# Altium schematic sheet VME_buffers.SchDoc: VME buffers
size 420 x 297 mm; CheckedBy: T.Janicki; CompanyName: Creotech Instruments SA; DrawnBy: G.Kasprowicz; Organization: CERN; Address1: European Organization for Nuclear Research; Address2: CH-1211 Geneve 23 - Switzerland; Revision: -; SheetNumber: 19; SheetTotal: 21; EDA_Number: EDA-xxxx; Projet: Simple VME FMC Carrier; ModifiedBy: -; CreateDate: 26/04/2012; CheckedDate: 30/04/2012; DivGrp: BE-CO; Designer: G.Kasprowicz; PageSetup: Record=PageOptions|CenterHorizontal=True|CenterVertical=True|PrintScale=0.95|XCorrection=1.00|YCorrection=1.00|PrintKind=1|BorderSize=5000000|LeftOffset=0|BottomOffset=0|Orientation=2|PaperLength=1000|PaperWidth=1000|Scale=100|PaperSource=15|PrintQuality=600|MediaType=1|DitherType=10|PaperKind=A3|PrintScaleMode=1; ModifiedDate: -
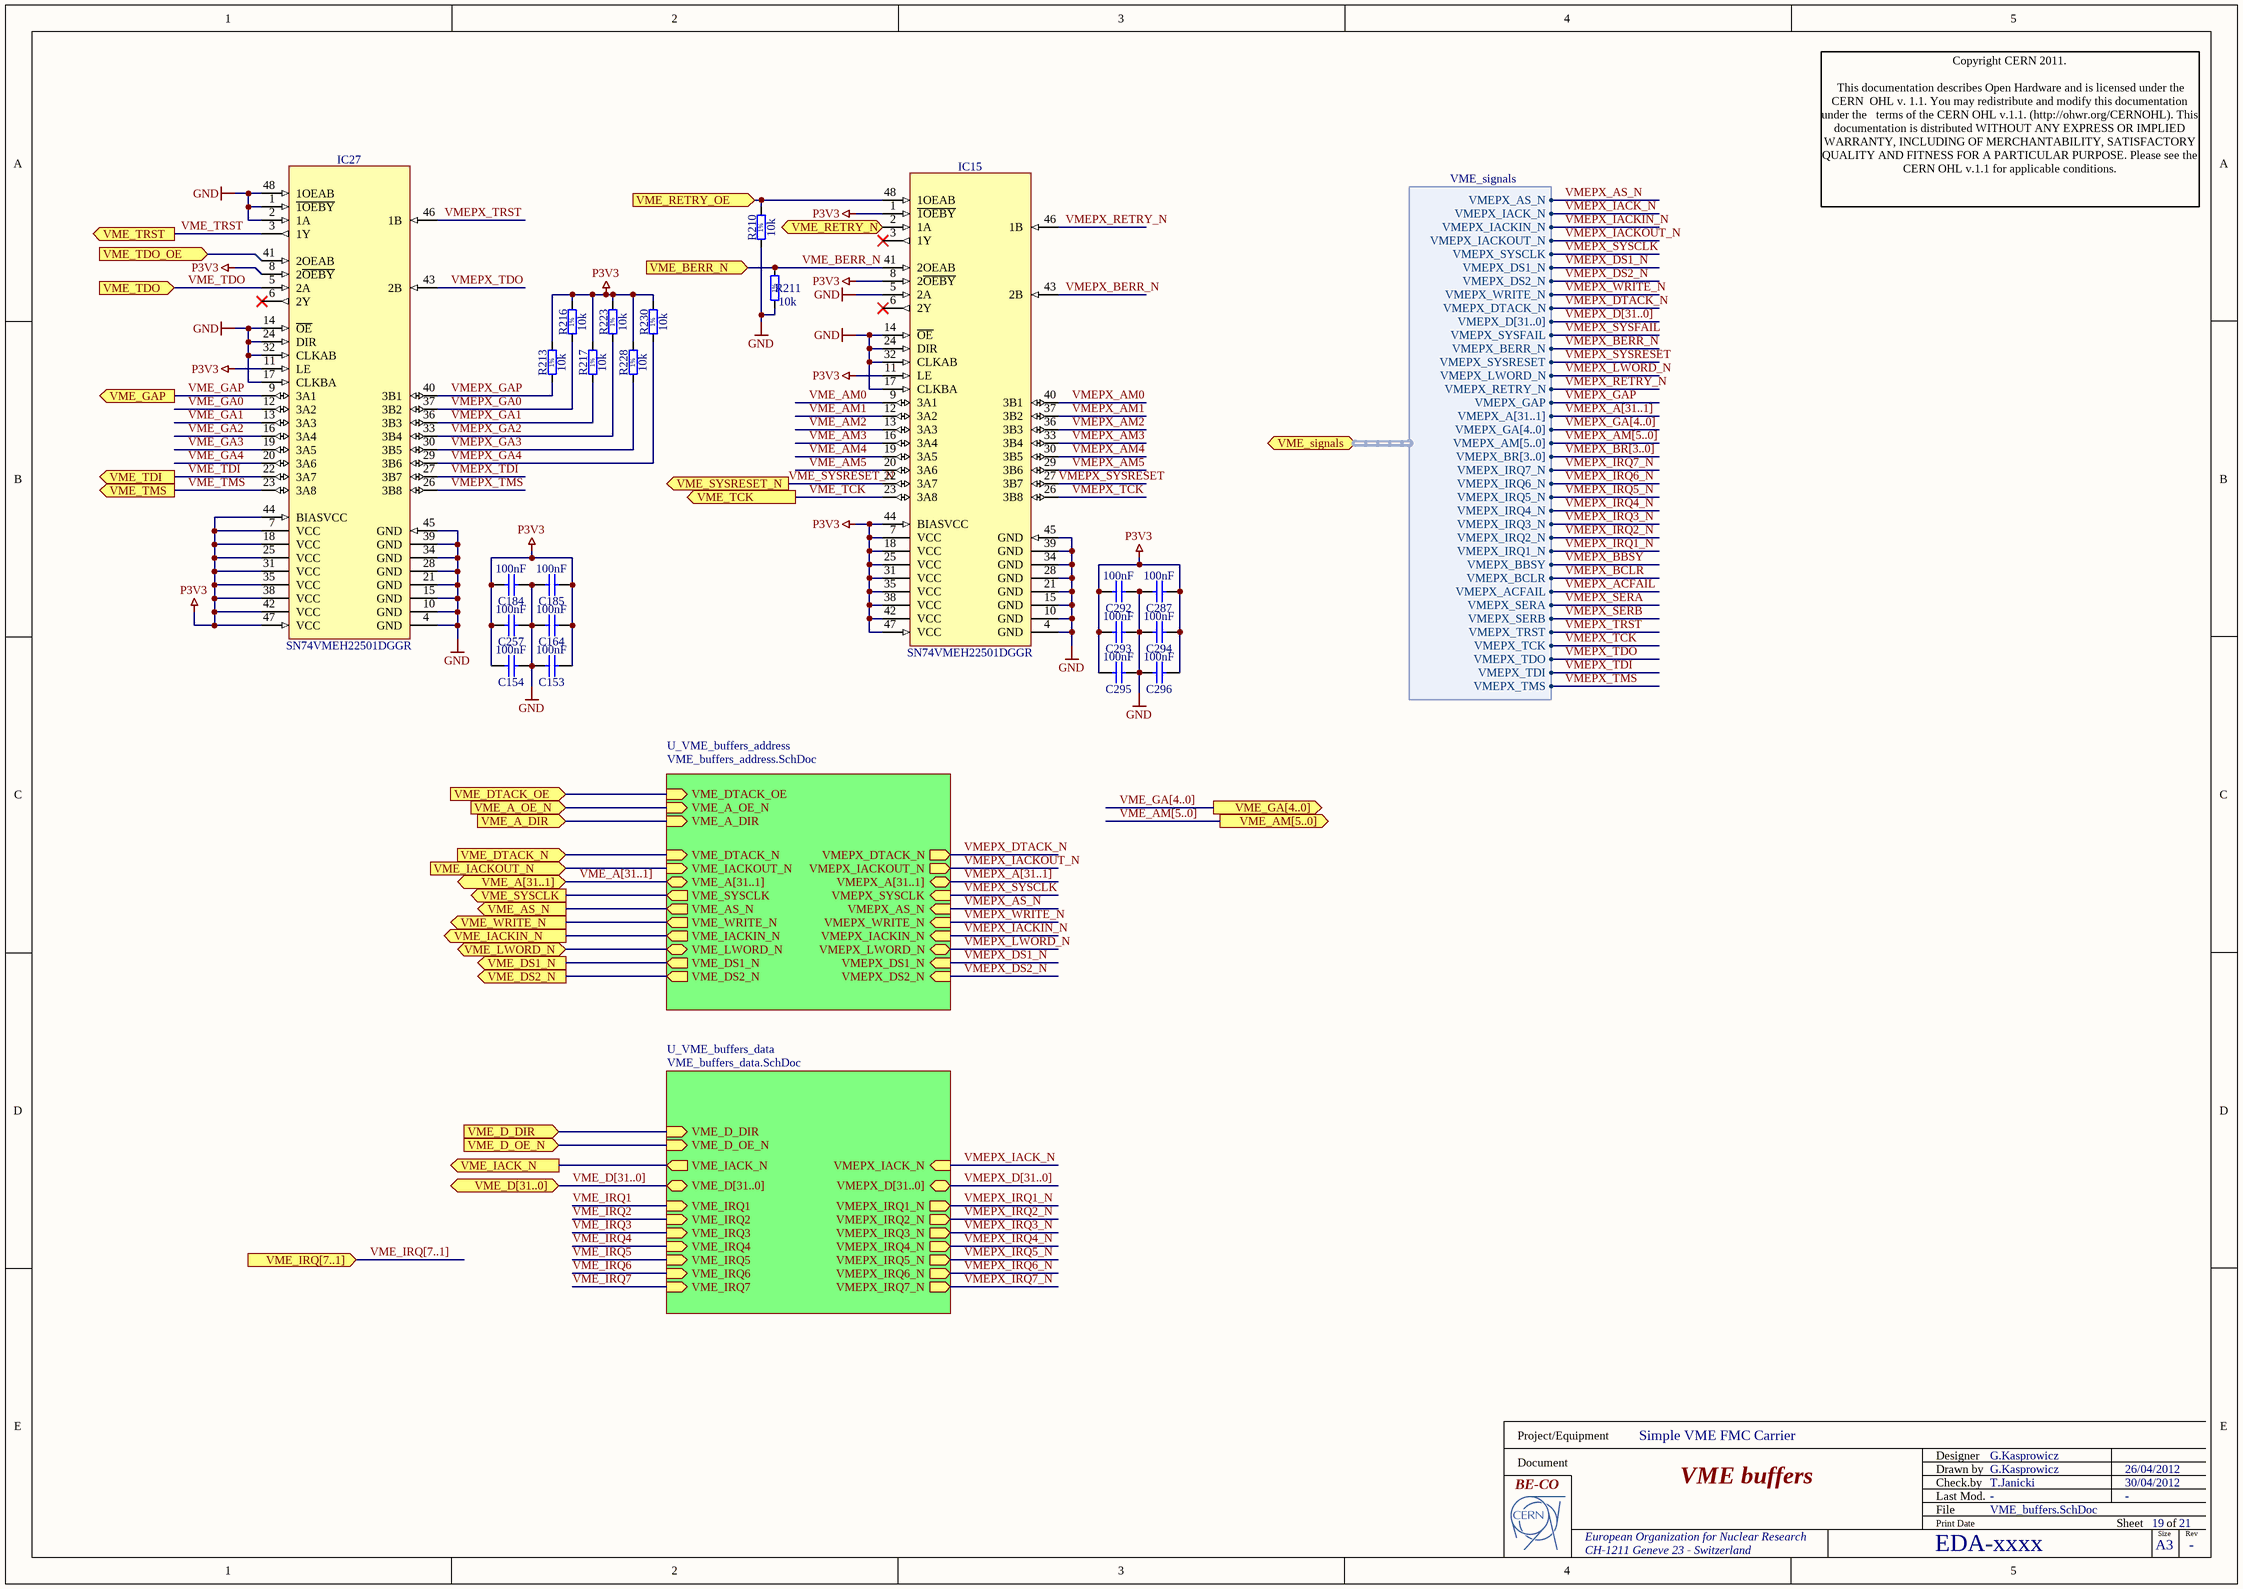
[diagram p0: VME_buffers.SchDoc]

## Parts
C153  100nF  [CAPC1005X55N]
C154  100nF  [CAPC1005X55N]
C164  100nF  [CAPC1005X55N]
C184  100nF  [CAPC1005X55N]
C185  100nF  [CAPC1005X55N]
C257  100nF  [CAPC1005X55N]
C287  100nF  [CAPC1005X55N]
C292  100nF  [CAPC1005X55N]
C293  100nF  [CAPC1005X55N]
C294  100nF  [CAPC1005X55N]
C295  100nF  [CAPC1005X55N]
C296  100nF  [CAPC1005X55N]
IC15  SN74VMEH22501DGGR  [SOP50P810X120-48N]
IC27  SN74VMEH22501DGGR  [SOP50P810X120-48N]
R210  10k  [RESC1608X55N]
R211  10k  [RESC1608X55N]
R213  10k  [RESC1608X55N]
R216  10k  [RESC1608X55N]
R217  10k  [RESC1608X55N]
R223  10k  [RESC1608X55N]
R228  10k  [RESC1608X55N]
R230  10k  [RESC1608X55N]

## Sub-sheets
U_VME_buffers_address = VME_buffers_address.SchDoc: VME_SYSCLK (out), VME_AS_N (out), VME_A[31..1] (bidir), VME_IACKIN_N (out), VME_IACKOUT_N (in), VME_DTACK_N (in), VME_WRITE_N (out), VME_DTACK_OE (in), VME_DS1_N (out), VME_DS2_N (out), VME_A_OE_N (in), VME_A_DIR (in), VMEPX_A[31..1] (bidir), VMEPX_SYSCLK (in), VMEPX_AS_N (in), VMEPX_DTACK_N (out), VMEPX_WRITE_N (in), VMEPX_IACKIN_N (in), VMEPX_IACKOUT_N (out), VMEPX_DS1_N (in), VMEPX_DS2_N (in), VME_LWORD_N (bidir), VMEPX_LWORD_N (bidir)
U_VME_buffers_data = VME_buffers_data.SchDoc: VME_IACK_N (out), VME_D[31..0] (bidir), VME_D_DIR (in), VME_D_OE_N (in), VMEPX_IACK_N (in), VME_IRQ1 (in), VME_IRQ7 (in), VME_IRQ6 (in), VME_IRQ5 (in), VME_IRQ4 (in), VME_IRQ3 (in), VME_IRQ2 (in), VMEPX_D[31..0] (bidir), VMEPX_IRQ1_N (out), VMEPX_IRQ7_N (out), VMEPX_IRQ6_N (out), VMEPX_IRQ5_N (out), VMEPX_IRQ4_N (out), VMEPX_IRQ3_N (out), VMEPX_IRQ2_N (out)

## Ports
VME_A[31..1] (bidir), VME_A_DIR (in), VME_A_OE_N (in), VME_AM[5..0] (out), VME_AS_N (out), VME_BERR_N (in), VME_D[31..0] (bidir), VME_D_DIR (in), VME_D_OE_N (in), VME_DS1_N (out), VME_DS2_N (out), VME_DTACK_N (in), VME_DTACK_OE (in), VME_GA[4..0] (out), VME_GAP (out), VME_IACK_N (out), VME_IACKIN_N (out), VME_IACKOUT_N (in), VME_IRQ[7..1] (in), VME_LWORD_N (bidir), VME_RETRY_N (in), VME_RETRY_OE (in), VME_signals (harness VME_signals), VME_SYSCLK (out), VME_SYSRESET_N (out), VME_TCK (out), VME_TDI (out), VME_TDO (in), VME_TDO_OE (in), VME_TMS (out), VME_TRST (out), VME_WRITE_N (out)

## Harnesses
VME_signals: VMEPX_AS_N, VMEPX_IACK_N, VMEPX_IACKIN_N, VMEPX_IACKOUT_N, VMEPX_SYSCLK, VMEPX_DS1_N, VMEPX_DS2_N, VMEPX_WRITE_N, VMEPX_DTACK_N, VMEPX_D[31..0], VMEPX_SYSFAIL, VMEPX_BERR_N, VMEPX_SYSRESET, VMEPX_LWORD_N, VMEPX_RETRY_N, VMEPX_GAP, VMEPX_A[31..1], VMEPX_GA[4..0], VMEPX_AM[5..0], VMEPX_BR[3..0], VMEPX_IRQ7_N, VMEPX_IRQ6_N, VMEPX_IRQ5_N, VMEPX_IRQ4_N, VMEPX_IRQ3_N, VMEPX_IRQ2_N, VMEPX_IRQ1_N, VMEPX_BBSY, VMEPX_BCLR, VMEPX_ACFAIL, VMEPX_SERA, VMEPX_SERB, VMEPX_TRST, VMEPX_TCK, VMEPX_TDO, VMEPX_TDI, VMEPX_TMS

## Nets
GND: C153.2 C154.1 C164.2 C184.1 C185.2 C257.1 C287.2 C292.1 C293.1 C294.2 C295.1 C296.2 IC15.4(GND) IC15.5(2A) IC15.10(GND) IC15.14(~{OE}) IC15.15(GND) IC15.17(CLKBA) IC15.21(GND) IC15.24(DIR) IC15.28(GND) IC15.32(CLKAB) IC15.34(GND) IC15.39(GND) IC15.45(GND) IC27.1(~{1OEBY}) IC27.2(1A) IC27.4(GND) IC27.10(GND) IC27.14(~{OE}) IC27.15(GND) IC27.17(CLKBA) IC27.21(GND) IC27.24(DIR) IC27.28(GND) IC27.32(CLKAB) IC27.34(GND) IC27.39(GND) IC27.45(GND) IC27.48(1OEAB) R210.1 R211.1
P3V3: C153.1 C154.2 C164.1 C184.2 C185.1 C257.2 C287.1 C292.2 C293.2 C294.1 C295.2 C296.1 IC15.1(~{1OEBY}) IC15.7(VCC) IC15.8(2~{OEBY}) IC15.11(LE) IC15.18(VCC) IC15.25(VCC) IC15.31(VCC) IC15.35(VCC) IC15.38(VCC) IC15.42(VCC) IC15.44(BIASVCC) IC15.47(VCC) IC27.7(VCC) IC27.8(2~{OEBY}) IC27.11(LE) IC27.18(VCC) IC27.25(VCC) IC27.31(VCC) IC27.35(VCC) IC27.38(VCC) IC27.42(VCC) IC27.44(BIASVCC) IC27.47(VCC) R213.2 R216.2 R217.2 R223.2 R228.2 R230.2
VME_A_DIR: port VME_A_DIR, sheet U_VME_buffers_address/VME_A_DIR
VME_A_OE_N: port VME_A_OE_N, sheet U_VME_buffers_address/VME_A_OE_N
VME_AM0: IC15.9(3A1)
VME_AM1: IC15.12(3A2)
VME_AM2: IC15.13(3A3)
VME_AM3: IC15.16(3A4)
VME_AM4: IC15.19(3A5)
VME_AM5: IC15.20(3A6)
VME_AS_N: port VME_AS_N, sheet U_VME_buffers_address/VME_AS_N
VME_BERR_N: IC15.41(2OEAB) R211.2 ; port VME_BERR_N
VME_D_DIR: port VME_D_DIR, sheet U_VME_buffers_data/VME_D_DIR
VME_D_OE_N: port VME_D_OE_N, sheet U_VME_buffers_data/VME_D_OE_N
VME_DS1_N: port VME_DS1_N, sheet U_VME_buffers_address/VME_DS1_N
VME_DS2_N: port VME_DS2_N, sheet U_VME_buffers_address/VME_DS2_N
VME_DTACK_N: port VME_DTACK_N, sheet U_VME_buffers_address/VME_DTACK_N
VME_DTACK_OE: port VME_DTACK_OE, sheet U_VME_buffers_address/VME_DTACK_OE
VME_GA0: IC27.12(3A2)
VME_GA1: IC27.13(3A3)
VME_GA2: IC27.16(3A4)
VME_GA3: IC27.19(3A5)
VME_GA4: IC27.20(3A6)
VME_GAP: IC27.9(3A1) ; port VME_GAP
VME_IACK_N: port VME_IACK_N, sheet U_VME_buffers_data/VME_IACK_N
VME_IACKIN_N: port VME_IACKIN_N, sheet U_VME_buffers_address/VME_IACKIN_N
VME_IACKOUT_N: port VME_IACKOUT_N, sheet U_VME_buffers_address/VME_IACKOUT_N
VME_IRQ1: sheet U_VME_buffers_data/VME_IRQ1
VME_IRQ2: sheet U_VME_buffers_data/VME_IRQ2
VME_IRQ3: sheet U_VME_buffers_data/VME_IRQ3
VME_IRQ4: sheet U_VME_buffers_data/VME_IRQ4
VME_IRQ5: sheet U_VME_buffers_data/VME_IRQ5
VME_IRQ6: sheet U_VME_buffers_data/VME_IRQ6
VME_IRQ7: sheet U_VME_buffers_data/VME_IRQ7
VME_LWORD_N: port VME_LWORD_N, sheet U_VME_buffers_address/VME_LWORD_N
VME_RETRY_N: IC15.2(1A) ; port VME_RETRY_N
VME_RETRY_OE: IC15.48(1OEAB) R210.2 ; port VME_RETRY_OE
VME_SYSCLK: port VME_SYSCLK, sheet U_VME_buffers_address/VME_SYSCLK
VME_SYSRESET_N: IC15.22(3A7) ; port VME_SYSRESET_N
VME_TCK: IC15.23(3A8) ; port VME_TCK
VME_TDI: IC27.22(3A7) ; port VME_TDI
VME_TDO: IC27.5(2A) ; port VME_TDO
VME_TDO_OE: IC27.41(2OEAB) ; port VME_TDO_OE
VME_TMS: IC27.23(3A8) ; port VME_TMS
VME_TRST: IC27.3(1Y) ; port VME_TRST
VME_WRITE_N: port VME_WRITE_N, sheet U_VME_buffers_address/VME_WRITE_N
VMEPX_ACFAIL: port VME_signals.VMEPX_ACFAIL
VMEPX_AM0: IC15.40(3B1)
VMEPX_AM1: IC15.37(3B2)
VMEPX_AM2: IC15.36(3B3)
VMEPX_AM3: IC15.33(3B4)
VMEPX_AM4: IC15.30(3B5)
VMEPX_AM5: IC15.29(3B6)
VMEPX_AS_N: sheet U_VME_buffers_address/VMEPX_AS_N, port VME_signals.VMEPX_AS_N
VMEPX_BBSY: port VME_signals.VMEPX_BBSY
VMEPX_BCLR: port VME_signals.VMEPX_BCLR
VMEPX_BERR_N: IC15.43(2B) ; port VME_signals.VMEPX_BERR_N
VMEPX_DS1_N: sheet U_VME_buffers_address/VMEPX_DS1_N, port VME_signals.VMEPX_DS1_N
VMEPX_DS2_N: sheet U_VME_buffers_address/VMEPX_DS2_N, port VME_signals.VMEPX_DS2_N
VMEPX_DTACK_N: sheet U_VME_buffers_address/VMEPX_DTACK_N, port VME_signals.VMEPX_DTACK_N
VMEPX_GA0: IC27.37(3B2) R216.1
VMEPX_GA1: IC27.36(3B3) R217.1
VMEPX_GA2: IC27.33(3B4) R223.1
VMEPX_GA3: IC27.30(3B5) R228.1
VMEPX_GA4: IC27.29(3B6) R230.1
VMEPX_GAP: IC27.40(3B1) R213.1 ; port VME_signals.VMEPX_GAP
VMEPX_IACK_N: sheet U_VME_buffers_data/VMEPX_IACK_N, port VME_signals.VMEPX_IACK_N
VMEPX_IACKIN_N: sheet U_VME_buffers_address/VMEPX_IACKIN_N, port VME_signals.VMEPX_IACKIN_N
VMEPX_IACKOUT_N: sheet U_VME_buffers_address/VMEPX_IACKOUT_N, port VME_signals.VMEPX_IACKOUT_N
VMEPX_IRQ1_N: sheet U_VME_buffers_data/VMEPX_IRQ1_N, port VME_signals.VMEPX_IRQ1_N
VMEPX_IRQ2_N: sheet U_VME_buffers_data/VMEPX_IRQ2_N, port VME_signals.VMEPX_IRQ2_N
VMEPX_IRQ3_N: sheet U_VME_buffers_data/VMEPX_IRQ3_N, port VME_signals.VMEPX_IRQ3_N
VMEPX_IRQ4_N: sheet U_VME_buffers_data/VMEPX_IRQ4_N, port VME_signals.VMEPX_IRQ4_N
VMEPX_IRQ5_N: sheet U_VME_buffers_data/VMEPX_IRQ5_N, port VME_signals.VMEPX_IRQ5_N
VMEPX_IRQ6_N: sheet U_VME_buffers_data/VMEPX_IRQ6_N, port VME_signals.VMEPX_IRQ6_N
VMEPX_IRQ7_N: sheet U_VME_buffers_data/VMEPX_IRQ7_N, port VME_signals.VMEPX_IRQ7_N
VMEPX_LWORD_N: sheet U_VME_buffers_address/VMEPX_LWORD_N, port VME_signals.VMEPX_LWORD_N
VMEPX_RETRY_N: IC15.46(1B) ; port VME_signals.VMEPX_RETRY_N
VMEPX_SERA: port VME_signals.VMEPX_SERA
VMEPX_SERB: port VME_signals.VMEPX_SERB
VMEPX_SYSCLK: sheet U_VME_buffers_address/VMEPX_SYSCLK, port VME_signals.VMEPX_SYSCLK
VMEPX_SYSFAIL: port VME_signals.VMEPX_SYSFAIL
VMEPX_SYSRESET: IC15.27(3B7) ; port VME_signals.VMEPX_SYSRESET
VMEPX_TCK: IC15.26(3B8) ; port VME_signals.VMEPX_TCK
VMEPX_TDI: IC27.27(3B7) ; port VME_signals.VMEPX_TDI
VMEPX_TDO: IC27.43(2B) ; port VME_signals.VMEPX_TDO
VMEPX_TMS: IC27.26(3B8) ; port VME_signals.VMEPX_TMS
VMEPX_TRST: IC27.46(1B) ; port VME_signals.VMEPX_TRST
VMEPX_WRITE_N: sheet U_VME_buffers_address/VMEPX_WRITE_N, port VME_signals.VMEPX_WRITE_N

Not connected (* = marked no-connect by the designer): IC15 3(1Y)* 6(2Y)*; IC27 6(2Y)*

## Buses and harness runs
bus VME_A[31..1] = port VME_A[31..1] = sheet U_VME_buffers_address/VME_A[31..1]
bus VME_AM[5..0] = port VME_AM[5..0]
bus VME_D[31..0] = port VME_D[31..0] = sheet U_VME_buffers_data/VME_D[31..0]
bus VME_GA[4..0] = port VME_GA[4..0]
bus VME_IRQ[7..1] = port VME_IRQ[7..1]
bus VMEPX_A[31..1]
bus VMEPX_A[31..1] = sheet U_VME_buffers_address/VMEPX_A[31..1]
bus VMEPX_AM[5..0]
bus VMEPX_BR[3..0]
bus VMEPX_D[31..0]
bus VMEPX_D[31..0] = sheet U_VME_buffers_data/VMEPX_D[31..0]
bus VMEPX_GA[4..0]

## Notes on the sheet
- Copyright CERN 2011.
  This documentation describes Open Hardware and is licensed under the CERN  OHL v. 1.1. You may redistribute and modify this documentation under the   terms of the CERN OHL v.1.1. (http://ohwr.org/CERNOHL). This  documentation is distributed WITHOUT ANY EXPRESS OR IMPLIED  WARRANTY, INCLUDING OF MERCHANTABILITY, SATISFACTORY  QUALITY AND FITNESS FOR A PARTICULAR PURPOSE. Please see the  CERN OHL v.1.1 for applicable conditions.
- Project/Equipment
- Document
- Designer
- Drawn by
- Check.by
- File
- Last Mod.
- Print Date
- Sheet
- Size
- A3
- of
- Rev
- (in symbol R0603_10K_1%_0.1W_100PPM) 1%

## Library data of the parts
C153 C154 C164 C184 C185 C257 C287 C292-C296 = CC0402_100NF_16V_10%_X7R: Non-polarised capacitor; Part Description: SMD Multilayer Chip Ceramic Capacitor; Manufacturer: GENERIC; Manufacturer1 Part Number: 223878715649; Voltage: 16V; TC: X7R; Tolerance: ±10%; Table: Capacitors SMD; Part Number: CC0402_100NF_16V_10%_X7R; Component Kind: Standard; Component Type: Standard; Pin Count: 2; Value: 100nF; Status: Not Recommended; Manufacturer Part Number: CC0402_100NF_16V_10%_X7R; Case: 0402; Mounted: Yes; Socket: No; SMD: Yes; Manufacturer1 Example: PHYCOMP; Manufacturer1 ComponentHeight: 0.55mm; HelpURL: \\cern.ch\dfs\Applications\Altium\Datasheets\CC0402_X7R_PHYCOMP.pdf; Author: CERN DEM JLC; CreateDate: 12/3/2007; LatestRevisionDate: 12/3/2007
IC15 IC27 = SN74VMEH22501DGGR: 8-Bit Universal Bus Transceiver and Two 1-Bit Bus Transceivers with 3-State Outputs; Manufacturer: TEXAS INSTRUMENTS; Table: Standard Logic; Part Number: SN74VMEH22501DGGR; Component Kind: Standard; Component Type: Standard; Device: SN74VMEH22501DGGR; PackageDescription: SOP, 48-Leads, Body 12.6x6.2mm (max), Pitch 0.50mm, IPC Medium Density; Part Description: 8-Bit Universal Bus Transceiver and Two 1-Bit Bus Transceivers with 3-State Outputs; Manufacturer Part Number: SN74VMEH22501DGGR; Pin Count: 48; Case: TSSOP48; Mounted: Yes; Socket: No; SMD: Yes; ComponentHeight: 1.2mm; Author: CERN DEM JLC; HelpURL: \\cern.ch\dfs\Applications\Altium\Datasheets\SN74VMEH22501DGGR.pdf; CreateDate: 10/27/2009; LatestRevisionDate: 10/27/2009
R210 R211 R213 R216 R217 R223 R228 R230 = R0603_10K_1%_0.1W_100PPM: Resistor - 1%; Part Description: General Purpose Thick Film Chip Resistor; Manufacturer: GENERIC; Manufacturer1 Part Number: NRC06F1002TRF; Power: 0.1W; TC: ±100ppm/°C; Table: Resistors SMD; Part Number: R0603_10K_1%_0.1W_100PPM; Component Kind: Standard; Component Type: Standard; Pin Count: 2; Value: 10k; Status: Preferred; Tolerance: ±1%; Manufacturer Part Number: R0603_10K_1%_0.1W_100PPM; Case: 0603; Mounted: Yes; Socket: No; SMD: Yes; Manufacturer1 Example: NIC COMPONENT; Manufacturer1 ComponentHeight: 0.55mm; HelpURL: \\cern.ch\dfs\Applications\Altium\Datasheets\R0603_NIC_NRC.pdf; Author: CERN DEM JLC; CreateDate: 2007-12-03; LatestRevisionDate: 2008-03-13